# Altium schematic sheet LED_Display.SchDoc
size A4
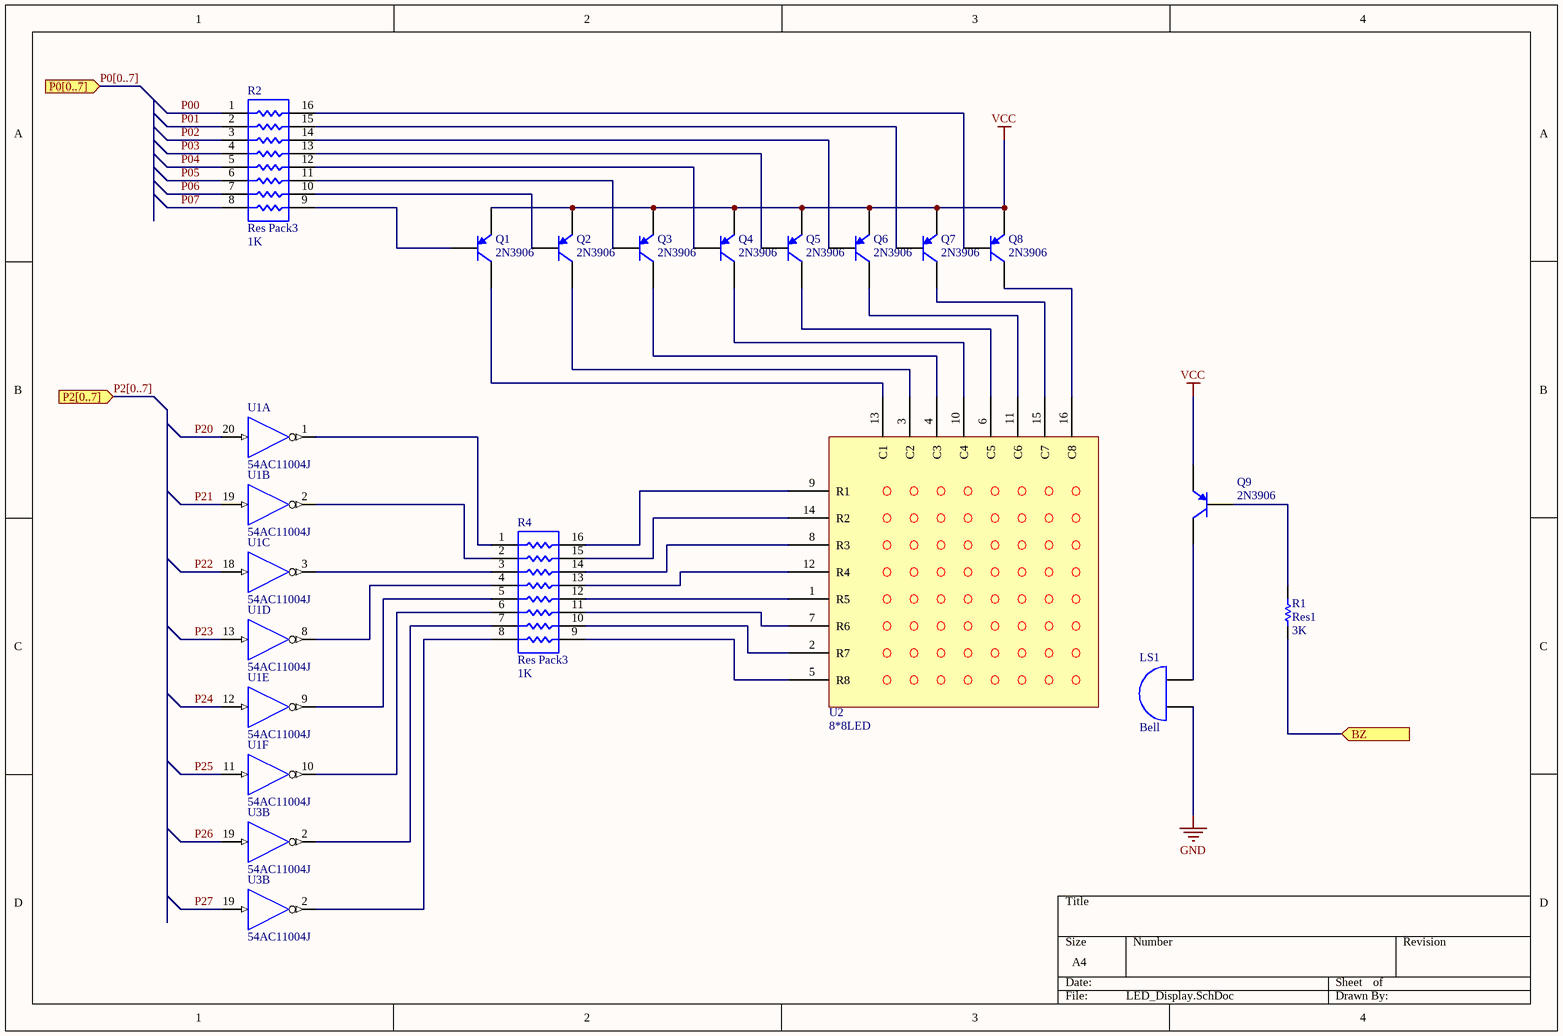
[diagram p0: LED_Display.SchDoc]

## Parts
(Parts that share a designator on the sheet are numbered #1, #2 ... from top to bottom, then left to right.)
LS1  Bell  [PIN2]
Q1  2N3906  [TO-92A]
Q2  2N3906  [TO-92A]
Q3  2N3906  [TO-92A]
Q4  2N3906  [TO-92A]
Q5  2N3906  [TO-92A]
Q6  2N3906  [TO-92A]
Q7  2N3906  [TO-92A]
Q8  2N3906  [TO-92A]
Q9  2N3906  [TO-92A]
R1  Res1  value 3K  [AXIAL-0.3]
R2  Res Pack3  value 1K  [SO-16_N]
R4  Res Pack3  value 1K  [SO-16_N]
U1  54AC11004J  [J020D]  (parts A,B,C,D,E,F of 6)
U2  8*8LED  [8*8LED]
U3#1  54AC11004J  [J020D]  (part B of 6)
U3#2  54AC11004J  [J020D]  (part B of 6)

## Ports
BZ (in), P0[0..7] (in), P2[0..7] (in)

## Nets
GND: LS1.1(A) U1.4(GND) U1.5(GND) U1.6(GND) U1.7(GND) U3#1.4(GND) U3#1.5(GND) U3#1.6(GND) U3#1.7(GND) U3#2.4(GND) U3#2.5(GND) U3#2.6(GND) U3#2.7(GND)
VCC: Q1.1(E) Q2.1(E) Q3.1(E) Q4.1(E) Q5.1(E) Q6.1(E) Q7.1(E) Q8.1(E) Q9.1(E) U1.15(VCC) U1.16(VCC) U3#1.15(VCC) U3#1.16(VCC) U3#2.15(VCC) U3#2.16(VCC)
BZ: R1.1 ; port BZ
P00: R2.1
P01: R2.2
P02: R2.3
P03: R2.4
P04: R2.5
P05: R2.6
P06: R2.7
P07: R2.8
P20: U1.20(A)
P21: U1.19(A)
P22: U1.18(A)
P23: U1.13(A)
P24: U1.12(A)
P25: U1.11(A)
P26: U3#1.19(A)
P27: U3#2.19(A)
NetLS1_2: LS1.2(B) Q9.3(C)
NetQ1_2: Q1.2(B) R2.9
NetQ1_3: Q1.3(C) U2.13(C1)
NetQ2_2: Q2.2(B) R2.10
NetQ2_3: Q2.3(C) U2.3(C2)
NetQ3_2: Q3.2(B) R2.11
NetQ3_3: Q3.3(C) U2.4(C3)
NetQ4_2: Q4.2(B) R2.12
NetQ4_3: Q4.3(C) U2.10(C4)
NetQ5_2: Q5.2(B) R2.13
NetQ5_3: Q5.3(C) U2.6(C5)
NetQ6_2: Q6.2(B) R2.14
NetQ6_3: Q6.3(C) U2.11(C6)
NetQ7_2: Q7.2(B) R2.15
NetQ7_3: Q7.3(C) U2.15(C7)
NetQ8_2: Q8.2(B) R2.16
NetQ8_3: Q8.3(C) U2.16(C8)
NetQ9_2: Q9.2(B) R1.2
NetR4_1: R4.1 U1.1(Y)
NetR4_2: R4.2 U1.2(Y)
NetR4_3: R4.3 U1.3(Y)
NetR4_4: R4.4 U1.8(Y)
NetR4_5: R4.5 U1.9(Y)
NetR4_6: R4.6 U1.10(Y)
NetR4_7: R4.7 U3#1.2(Y)
NetR4_8: R4.8 U3#2.2(Y)
NetR4_9: R4.9 U2.5(R8)
NetR4_10: R4.10 U2.2(R7)
NetR4_11: R4.11 U2.7(R6)
NetR4_12: R4.12 U2.1(R5)
NetR4_13: R4.13 U2.12(R4)
NetR4_14: R4.14 U2.8(R3)
NetR4_15: R4.15 U2.14(R2)
NetR4_16: R4.16 U2.9(R1)

## Buses and harness runs
bus P0[0..7] = port P0[0..7]
bus P2[0..7] = port P2[0..7]

## Library data of the parts
LS1 = Bell: Electrical Bell; Published: 24-Mar-1999; LatestRevisionDate: 17-Jul-2002; LatestRevisionNote: Re-released for DXP Platform.; PackageReference: PIN2; Publisher: Altium Limited
Q1-Q9 = 2N3906: PNP General Purpose Amplifier; Published: 8-Jun-2000; LatestRevisionDate: 15-Jan-2003; LatestRevisionNote: PCB Footprint 'BCY-W3/D4.7' replaced; DatasheetVersion: 1997; PackageVersion: Sep-1998; PackageReference: TO-92A; Publisher: Altium Limited; PackageDescription: TO, Flat Index; 3 In-Line, Axial Leads; Body Dia. 4.5mm; Leads 0.51 x 0.48 mm (max); ComponentLink1Description: Manufacturer Link; ComponentLink1URL: http://www.fairchildsemi.com/; ComponentLink2Description: Datasheet; ComponentLink2URL: http://www.fairchildsemi.com/ds/2N%2F2N3906.pdf
R1 = Res1: Resistor; Published: 8-Jun-2000; LatestRevisionDate: 17-Jul-2002; LatestRevisionNote: Re-released for DXP Platform.; PackageReference: AXIAL-0.3; Publisher: Altium Limited; PackageDescription: Axial Device, Thru-Hole; 2 Leads; 0.3 in Pin Spacing
R2 R4 = Res Pack3: Isolated Resistor Network; Published: 24-Mar-1999; LatestRevisionDate: 29-May-2009; LatestRevisionNote: IPC-7351 Footprint Added.; PackageReference: SO-16; Publisher: Altium Limited; PackageDescription: 16-Pin Small Outline Integrated Circuit 1.27 mm Pitch; Code_JEDEC: MS-012-AC; Code_IPC: SOIC127P600-16
U1 U3#1 U3#2 = 54AC11004J: Hex Inverter; Note: Pins 14 and 17 are not connected and not drawn; Published: 8-Jun-2000; LatestRevisionDate: 04-Mar-2005; LatestRevisionNote: Stylized 3D Model Added.; DatasheetVersion: Mar-1990; PackageVersion: Jun-1999; PackageReference: J020D; Publisher: Altium Limited; PackageDescription: DIP; 20 Leads; Row Spacing 7.62 mm; Pitch 2.54 mm; ComponentLink1Description: Manufacturer Link; ComponentLink1URL: http://www.ti.com/; ComponentLink2Description: Packaging Specification; ComponentLink2URL: http://focus.ti.com/lit/ml/mcer002d/mcer002d.pdf